# EAGLE schematic ajile_ximea_trigger_adapter (EAGLE 9.0.1)
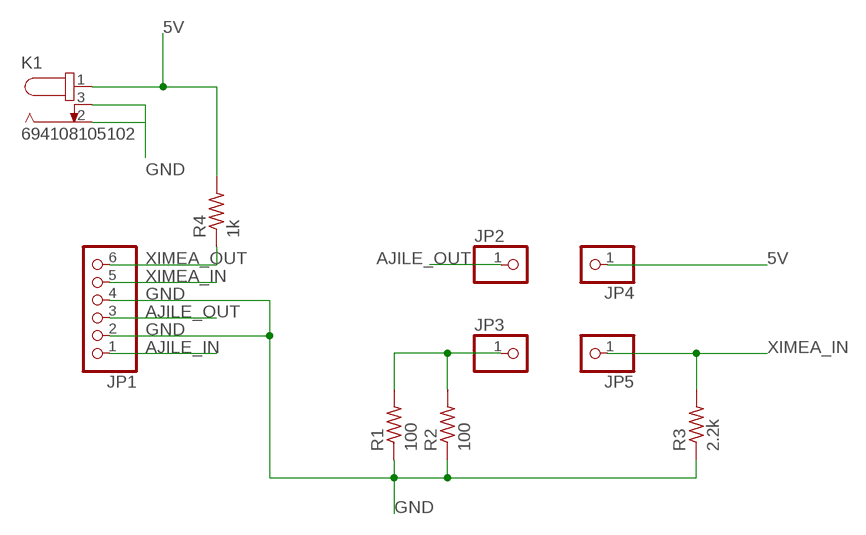
[diagram p0: schematic, sheet 1]

## Parts
JP1  PINHD-1X6  [1X06]
JP2  PINHD-1X1  [1X01]
JP3  PINHD-1X1  [1X01]
JP4  PINHD-1X1  [1X01]
JP5  PINHD-1X1  [1X01]
K1  694108105102  [694108105102]
R1  100  R-US_0204/7  [0204/7]
R2  100  R-US_0204/7  [0204/7]
R3  2.2k  R-US_0204/7  [0204/7]
R4  1k  R-US_0204/7  [0204/7]

## Nets
5V: JP4.1 K1.1 R4.2
AJILE_IN: JP1.1
AJILE_OUT: JP1.3 JP2.1
GND: JP1.2 JP1.4 K1.2 K1.3 R1.1 R2.1 R3.1
N$2: JP3.1 R1.2 R2.2
XIMEA_IN: JP1.5 JP5.1 R3.2
XIMEA_OUT: JP1.6 R4.1

## Library data of the parts
JP1 = pinhead:PINHD-1X6: PIN HEADER
JP2-JP5 = pinhead:PINHD-1X1: PIN HEADER
K1 = Wurth_Elektronik_Electromechanic_DC_Power_Jack_Connectors_rev15c:694108105102: WR-DC_DC Power Jack_Right Angled_SMT Center Pin Ø2.5_Plug ID Ø2.55_Plug OD Ø5.5_with Peg ;=>Code : Con_WR-DC_SMT_694106105102_694108105102 <http://katalog.we-online.de/media/images/eican/Con_WR-DC_SMT_694106105102_pf2.jpg> Details see: http://katalog.we-online.de/em/datasheet/6941xx105102.pdf Created 2014-10-08, Karrer Zheng 2014 (C) Wurth Elektronik
R1-R4 = rcl:R-US_: RESISTOR, American symbol; SPICEPREFIX: R